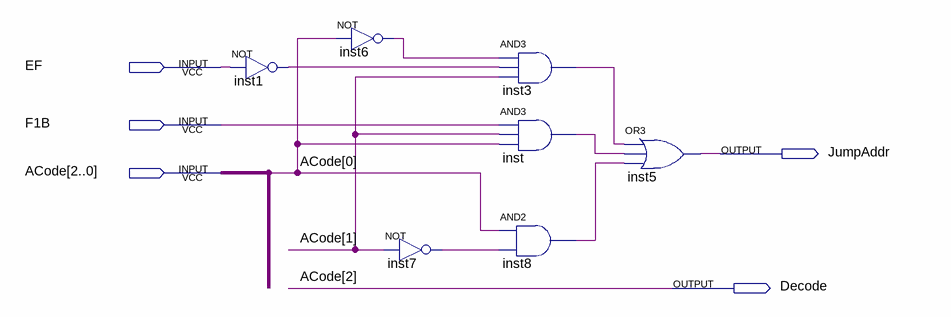
[diagram p0: schematic sheet]
// Quartus schematic JumpDecodeUnit.bdf as structural Verilog: 7 symbols, 5 pins
module JumpDecodeUnit (
  input  EF,
  input  F1B,
  input  [2:0] ACode,
  output JumpAddr,
  output Decode
);

  wire inst1_out, inst3_out, inst6_out, inst7_out, inst8_out, inst_out;

  not inst1 (inst1_out, EF);
  not inst6 (inst6_out, ACode[0]);
  not inst7 (inst7_out, ACode[1]);
  and inst3 (inst3_out, inst6_out, inst1_out, ACode[1]);
  and inst (inst_out, F1B, ACode[1], ACode[0]);
  and inst8 (inst8_out, ACode[0], inst7_out);
  or inst5 (JumpAddr, inst3_out, inst_out, inst8_out);

  assign Decode = ACode[2];
endmodule
